# EAGLE design ps (EAGLE 7.6.0)
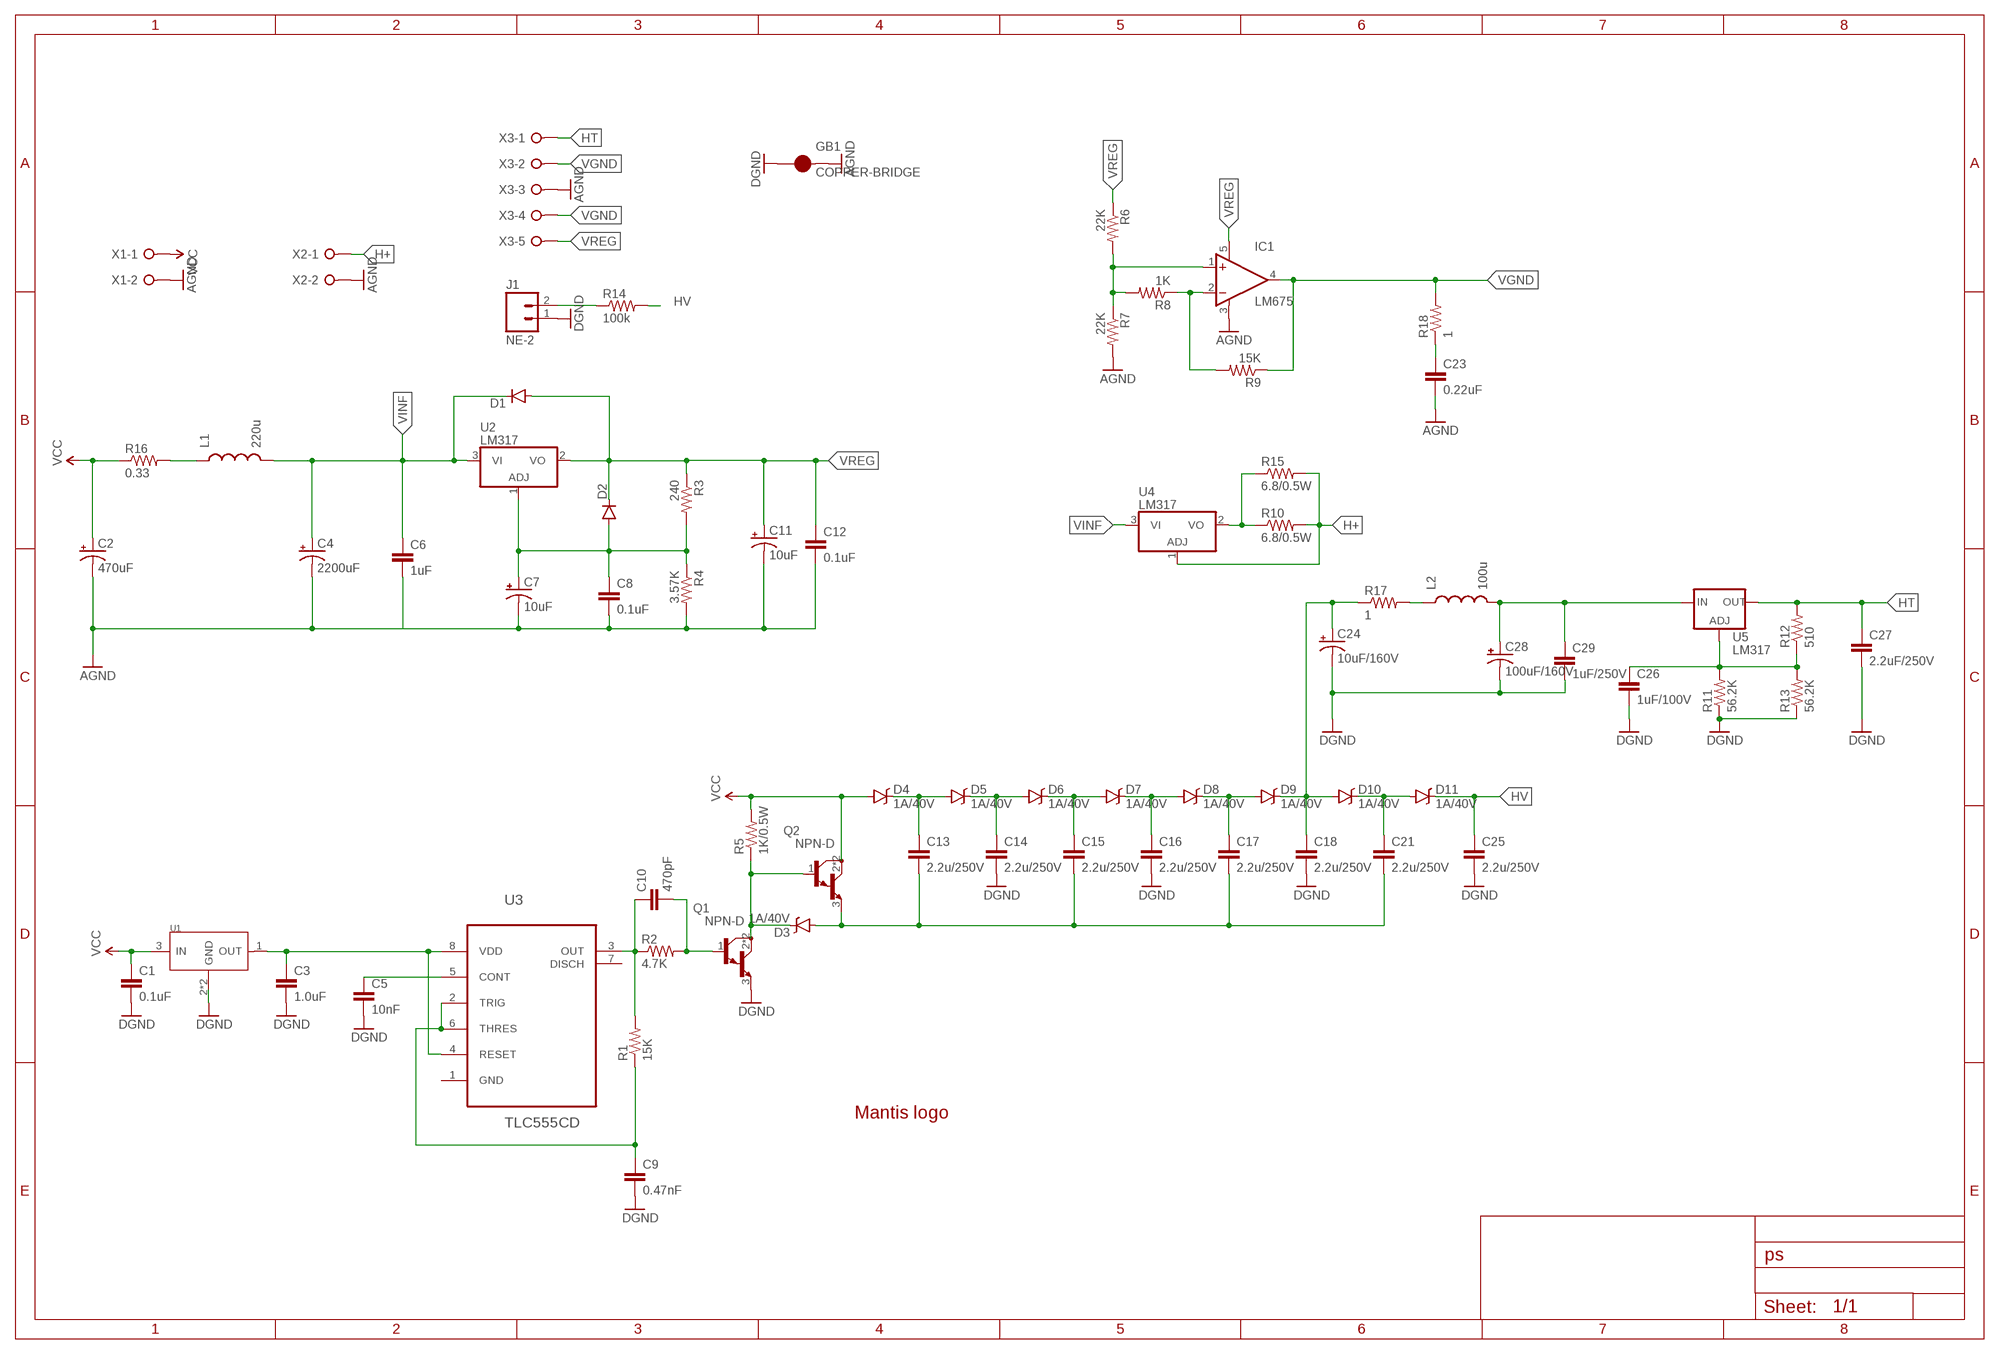
[diagram p0: schematic, sheet 1]

## Parts
C1  0.1uF  0.1UF-25V(+80/-20%)(0603)  [0603-CAP]
C2  470uF  CAP_POLPTH4  [CPOL-RADIAL-1000UF-25V]
C3  1.0uF  1.0UF-25V-+80/-20(0805)"  [0805-CAP]
C4  2200uF  CAP_POLPTH3  [CPOL-RADIAL-1000UF-63V]
C5  10nF  10NF/10000PF-50V-10%(0603)  [0603-CAP]
C6  1uF  1UF-25V-10%(0805)"  [0805-CAP]
C7  10uF  CAP_POLC  [PANASONIC_C]
C8  0.1uF  0.1UF-25V-5%(0603)  [0603-CAP]
C9  0.47nF  4.7NF-50V-10%(0603)  [0603-CAP]
C10  470pF  470PF-50V-5%(0603)SMD  [0603-CAP]
C11  10uF  CAP_POLC  [PANASONIC_C]
C12  0.1uF  0.1UF-25V-5%(0603)  [0603-CAP]
C13  2.2u/250V  C-EUC2220K  [C2220K]
C14  2.2u/250V  C-EUC2220K  [C2220K]
C15  2.2u/250V  C-EUC2220K  [C2220K]
C16  2.2u/250V  C-EUC2220K  [C2220K]
C17  2.2u/250V  C-EUC2220K  [C2220K]
C18  2.2u/250V  C-EUC2220K  [C2220K]
C21  2.2u/250V  C-EUC2220K  [C2220K]
C23  0.22uF  0.22UF-25V-10%(0603)  [0603-CAP]
C24  10uF/160V  CAP_POLPTH4  [CPOL-RADIAL-1000UF-25V]
C25  2.2u/250V  C-EUC2220K  [C2220K]
C26  1uF/100V  CAP1210  [1210]
C27  2.2uF/250V  C-EUC2220K  [C2220K]
C28  100uF/160V  CAP_POLPTH4  [CPOL-RADIAL-1000UF-25V]
C29  1uF/250V  C-EUC2220K  [C2220K]
D1  DIODESOD123  [SOD-123]
D2  DIODESOD123  [SOD-123]
D3  1A/40V  DIODE-SCHOTTKY-B340A  [SMA-DIODE]
D4  1A/40V  DIODE-SCHOTTKY-B340A  [SMA-DIODE]
D5  1A/40V  DIODE-SCHOTTKY-B340A  [SMA-DIODE]
D6  1A/40V  DIODE-SCHOTTKY-B340A  [SMA-DIODE]
D7  1A/40V  DIODE-SCHOTTKY-B340A  [SMA-DIODE]
D8  1A/40V  DIODE-SCHOTTKY-B340A  [SMA-DIODE]
D9  1A/40V  DIODE-SCHOTTKY-B340A  [SMA-DIODE]
D10  1A/40V  DIODE-SCHOTTKY-B340A  [SMA-DIODE]
D11  1A/40V  DIODE-SCHOTTKY-B340A  [SMA-DIODE]
GB1  COPPER-BRIDGE  [COPPER-BRIDGE]
IC1  LM675  [TO220-5]
J1  NE-2  M02PTH  [1X02]
L1  220u  INDUCTORNR10050T-PTH-ADD  [NR10050T-PTH-ADD]
L2  100u  INDUCTOR1210  [1210]
LOGO1  LOGO-MANTIS  [LOGO-MANTIS]
Q1  NPN-D  [SOT223]
Q2  NPN-D  [SOT223]
R1  15K  15KOHM1/10W1%(0603)0603  [0603-RES]
R2  4.7K  10KOHM-1/10W-1%(0603)0603  [0603-RES]
R3  240  RESISTORPTH-1/4W  [AXIAL-0.4]
R4  3.57K  RESISTORPTH-1/4W  [AXIAL-0.4]
R5  1K/0.5W  R-US_R1210W  [R1210W]
R6  22K  RESISTORPTH-1/4W  [AXIAL-0.4]
R7  22K  RESISTORPTH-1/4W  [AXIAL-0.4]
R8  1K  RESISTORPTH-1/4W  [AXIAL-0.4]
R9  15K  RESISTORPTH-1/4W  [AXIAL-0.4]
R10  6.8/0.5W  RESISTORPTH-1/2W  [AXIAL-0.5]
R11  56.2K  RESISTORPTH-1/4W  [AXIAL-0.4]
R12  510  RESISTORPTH-1/4W  [AXIAL-0.4]
R13  56.2K  RESISTORPTH-1/4W  [AXIAL-0.4]
R14  100k  100KOHM-1/10W-1%(0603)  [0603-RES]
R15  6.8/0.5W  RESISTORPTH-1/2W  [AXIAL-0.5]
R16  0.33  RESISTORPTH-1/4W  [AXIAL-0.4]
R17  1  RESISTORPTH-1/4W-VERT  [AXIAL-0.1]
R18  1  RESISTORPTH-1/4W  [AXIAL-0.4]
U1  L78L12ACUTR  [SOT-89]
U2  LM317  [TO220BV]
U3  TLC555CD  [SOIC127P600X175-8N]
U4  LM317  [TO220BV]
U5  LM317  V_REG_317DPACK  [V-REG_DPACK]
X1  W237-02P  [W237-132]
X2  W237-02P  [W237-132]
X3  W237-05P  [W237-5P]

## Nets
555CONT: C5.1 U3.5(CONT)
555OUT: C10.1 R1.2 R2.1 U3.3(OUT)
555TRIG: C9.1 R1.1 U3.2(TRIG) U3.6(THRES)
555VDD: C3.1 U1.1(OUT) U3.4(RESET) U3.8(VDD)
AGND: C2.- C4.2(-) C6.2 C7.- C8.2 C11.- C12.2 C23.2 GB1.P$2.1 GB1.P$2.2 IC1.3(V-) R4.P$2 R7.P$2 X1.2 X2.2 X3.3
GND: C1.2 C3.2 C5.2 C9.2 C14.2 C16.2 C18.2 C24.- C25.2 C26.2 C27.2 C28.- C29.2 GB1.P$1.1 GB1.P$1.2 J1.1 Q1.3(E) R11.P$1 R13.P$1 U1.2(GND) U1.PAD(GND) ; supply symbol labelled DGND
H+: R10.P$2 R15.P$2 U4.1(ADJ) X2.1
HT [pwr]: C27.1 R12.P$2 U5.4(OUT) X3.1
HV [pwr]: C25.1 D11.C R14.2
N$1 [pwr]: D3.C Q1.2(C) Q1.4(C) Q2.1(B) R5.1
N$2: IC1.1(+IN) R6.P$2 R7.P$1 R8.P$2
N$3: IC1.2(-IN) R8.P$1 R9.P$2
N$4 [pwr]: C21.1 D10.C D11.A
N$5: J1.2 R14.1
N$6 [pwr]: C13.1 D4.C D5.A
N$7 [pwr]: C28.+ C29.1 L2.2 U5.3(IN)
N$8: R10.P$1 R15.P$1 U4.2(VO)
N$9 [pwr]: L1.P$1 L1.P$1.1 R16.P$2
N$10: C10.2 Q1.1(B) R2.2
N$11 [pwr]: C14.1 D5.C D6.A
N$12 [pwr]: C15.1 D6.C D7.A
N$13 [pwr]: C16.1 D7.C D8.A
N$14 [pwr]: C17.1 D8.C D9.A
N$15 [pwr]: C18.1 C24.+ D9.C D10.A R17.P$1
N$16: L2.1 R17.P$2
N$17 [pwr]: C23.1 R18.P$1
N$18: C26.1 R11.P$2 R12.P$1 R13.P$2 U5.1(ADJ)
PUMPIN [pwr]: C13.2 C15.2 C17.2 C21.2 D3.A Q2.3(E)
REGADJ [pwr]: C7.+ C8.1 D2.A R3.P$2 R4.P$1 U2.1(ADJ)
VCC [pwr]: C1.1 C2.+ D4.A Q2.2(C) Q2.4(C) R5.2 R16.P$1 U1.3(IN) X1.1
VGND [pwr]: IC1.4(OUT) R9.P$1 R18.P$2 X3.2 X3.4
VINF [pwr]: C4.1(+) C6.1 D1.C L1.P$2 L1.P$2.1 U2.3(VI) U4.3(VI)
VREG [pwr]: C11.+ C12.1 D1.A D2.C IC1.5(V+) R3.P$1 R6.P$1 U2.2(VO) X3.5
Unconnected: U3.1(GND) U3.7(DISCH)

## Library data of the parts
C1 = SparkFun-Capacitors:0.1UF-25V(+80/-20%)(0603): CAP-00810 Ceramic Standard decoupling cap; PROD_ID: CAP-00810
C2 C4 C7 C11 C24 C28 = SparkFun-Capacitors:CAP_POL: Capacitor Polarized These are standard SMD and PTH capacitors. Normally 10uF, 47uF, and 100uF in electrolytic and tantalum varieties. Always verify the external diameter of the through hole cap, it varies with capacity, voltage, and manufacturer. The EIA devices should be standard.
C3 = SparkFun-Capacitors:1.0UF-25V-+80/-20(0805): CAP-11625; PROD_ID: CAP-11625
C5 = SparkFun-Capacitors:10NF/10000PF-50V-10%(0603): CAP-00867; PROD_ID: CAP-00867
C6 = SparkFun-Capacitors:1UF-25V-10%(0805): CAP-08064
C8 C12 = SparkFun-Capacitors:0.1UF-25V-5%(0603): CAP-08604; PROD_ID: CAP-08604
C9 = SparkFun-Capacitors:4.7NF-50V-10%(0603): CAP-11378; PROD_ID: CAP-11378; VALUE: 4.7nF
C10 = SparkFun-Capacitors:470PF-50V-5%(0603): CAP-07884; PROD_ID: CAP-07884
C13-C18 C21 C25 C27 C29 = rcl:C-EU: CAPACITOR, European symbol
C23 = SparkFun-Capacitors:0.22UF-25V-10%(0603): CAP-07822; PROD_ID: CAP-07822
C26 = SparkFun-Capacitors:CAP: Capacitor Standard 0603 ceramic capacitor, and 0.1" leaded capacitor.
D1 D2 = SparkFun-DiscreteSemi:DIODE: Diode These are standard reverse protection diodes and small signal diodes. SMA package can handle up to about 1A. SOD-323 can handle about 200mA. What the SOD-323 package when ordering, there are some mfgs out there that are 5-pin packages.
D3-D11 = SparkFun-DiscreteSemi:DIODE-SCHOTTKY: Schottky diodes in SFE's production catalog BAT20J 1A 23V 0.62Vf RB751 120mA 40V 0.37Vf PMEG4005EJ 0.5A 40V 0.42Vf MBRA140 1A 40V 0.5Vf B340A 3A 40V SMA; PROD_ID: DIO-09886; VALUE: B340A
GB1 = my:COPPER-BRIDGE
IC1 = my:LM675: Power Operational Amplifier
J1 = SparkFun-Connectors:M02: Standard 2-pin 0.1" header. Use with - straight break away headers ( PRT-00116) - right angle break away headers (PRT-00553) - swiss pins (PRT-00743) - machine pins (PRT-00117) - female headers (PRT-00115) Molex polarized connector foot print use with: PRT-08233 with associated crimp pins and housings. 2.54_SCREWTERM for use with PRT-10571. 3.5mm Screw Terminal footprints for PRT-08084 5mm Screw Terminal footprints for use with PRT-08432
L1 = my:INDUCTOR: Inductors Basic Inductor/Choke - 0603 and 1206. Footprints are not proven and vary greatly between part numbers. INDUCTOR POWER 3.3UH 4.0A SMD 0.197" L x 0.197" W x 0.177" H (5.00mm x 5.00mm x 4.50mm)
L2 = SparkFun-Passives:INDUCTOR: Inductors Basic Inductor/Choke - 0603 and 1206. Footprints are not proven and vary greatly between part numbers. INDUCTOR POWER 3.3UH 4.0A SMD 0.197" L x 0.197" W x 0.177" H (5.00mm x 5.00mm x 4.50mm); MOUSER_PRICE: 0.168; MOUSER_SKU: 963-LB3218T101K
LOGO1 = my:LOGO-MANTIS: Mantis logo
Q1 Q2 = my:NPN-D: Generic NPN Darlington transistor
R1 = SparkFun-Resistors:15KOHM1/10W1%(0603): RES-07854; PROD_ID: RES-07854
R2 = SparkFun-Resistors:10KOHM-1/10W-1%(0603): RES-00824; PROD_ID: RES-00824; VALUE: 10K
R3 R4 R6-R13 R15-R18 = SparkFun-Resistors:RESISTOR: Resistor Basic schematic elements and footprints for 0603, 1206, and PTH resistors.
R5 = rcl:R-US_: RESISTOR, American symbol
R14 = SparkFun-Resistors:100KOHM-1/10W-1%(0603): RES-07828; PROD_ID: RES-07828
U1 = my:L78L12ACUTR: 310030095
U2 U4 = my:LM317
U3 = Texas Instruments_By_element14_Batch_1:TLC555CD: LINCMOS TIMER; MPN: TLC555CD; OC_FARNELL: 1106128; OC_NEWARK: 67K1265; PACKAGE: SOIC-8; SUPPLIER: Texas Instruments
U5 = SparkFun-PowerIC:V_REG_317: Voltage Regulator Standard LM317 adjustable voltage regulator. AOI (Adjust Output Input). Google 'LM317 Calculator' for easy to use app to get the two resistor values needed. 240/720 for 5V output. 240/390 for 3.3V output. Spark Fun Electronics SKU : COM-00527; PROD_ID: IC-09888
X1 X2 = con-wago-508:W237-02P: WAGO SREW CLAMP; OC_FARNELL: unknown; OC_NEWARK: unknown
X3 = con-wago-508:W237-05P: WAGO SREW CLAMP; OC_FARNELL: unknown; OC_NEWARK: unknown

## Net classes
1 pwr: width 1.27 mm

## Board
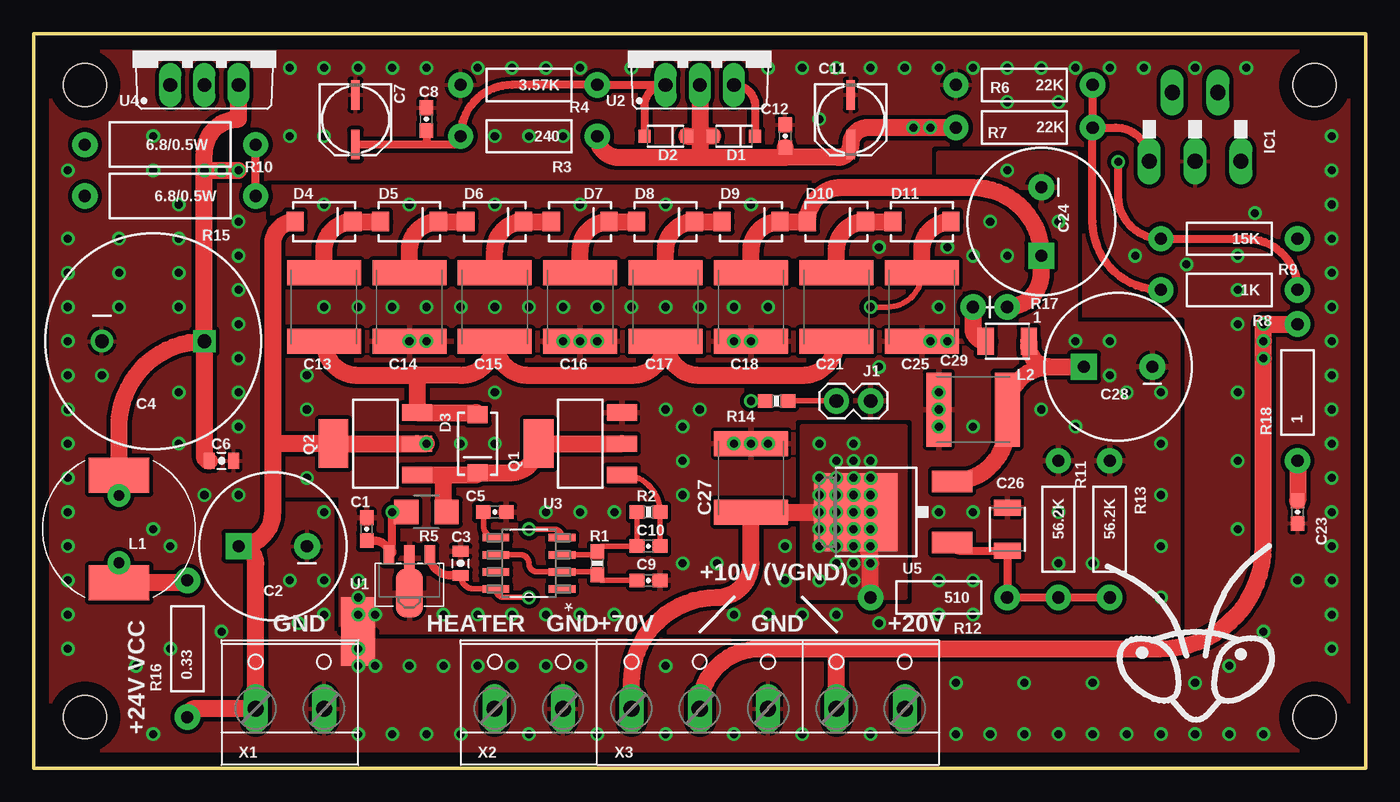
[diagram p1: board, top side]
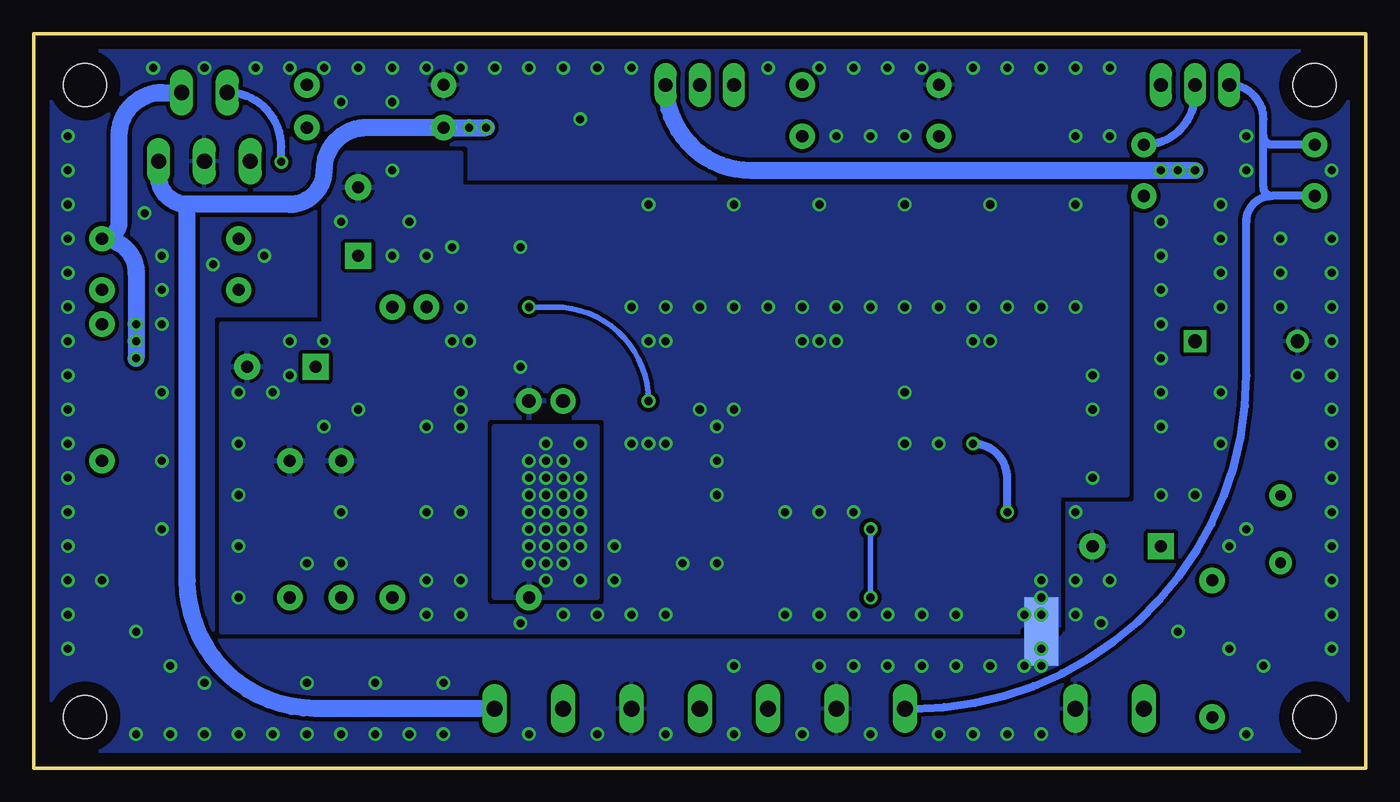
[diagram p2: board, bottom side, seen from below]

Size 99.06 x 54.61 mm. Coordinates in mm from the lower left corner, seen from the top.
Outline: 0,0 0,54.61 99.06,54.61 99.06,0 0,0
Copper layers (1*16): Top 0.035mm / dielectric 1.5mm / Bottom 0.035mm
Design rules "default *": minimum track width 10mil, minimum drill 20mil, track to track 12mil, track to pad 12mil, pad to pad 12mil, via to via 12mil, smd to smd 8mil, copper to edge 40mil, drill to drill 8mil, minimum pad ring 12mil, minimum via ring 8mil, stop-mask expansion 4mil, vias tented up to drill 0mil, thermal gap 10mil
Holes 3.2 mm at 3.81,3.81 3.81,50.8 95.25,50.8 95.25,3.81

### Footprints (pad centres in the part's own frame; a part is rotated, then mirrored left to right if it is on the bottom)
0603-CAP = smd 1.1 x 1: 1 -0.85,0; 2 0.85,0
CPOL-RADIAL-1000UF-25V = drill 0.9 pad 1.93 square: + 2.54,0 | drill 0.9 pad 1.93: - -2.54,0
0805-CAP = smd 0.8 x 1.2: 1 -0.9,0; 2 0.9,0
CPOL-RADIAL-1000UF-63V = drill 1.016 pad 1.651 square: 1 3.81,0 | drill 1.016 pad 1.676: 2 -3.81,0
PANASONIC_C = smd 2.2 x 0.65: + 1.9,-0.2; - -1.8,-0.2
C2220K = smd 1.85 x 5.5: 1 -2.55,0; 2 2.55,0
1210 = smd 1.2 x 2: 1 -1.6,0; 2 1.6,0
SOD-123 = smd 0.9 x 0.95: A 1.575,0; C -1.575,0
SMA-DIODE = smd 1.27 x 1.47: A -2.15,0; C 2.15,0
COPPER-BRIDGE = smd 2.54 x 2.565: P$1.1 0,1.27; P$2.1 0,-1.27 | smd 2.54 x 2.565 bottom: P$1.2 0,1.27; P$2.2 0,-1.27
TO220-5 = drill 1.118 pad 1.626 long: 1 -3.404,-8.211; 2 -1.702,-3.105; 3 0,-8.211; 4 1.702,-3.105; 5 3.404,-8.211
1X02 = drill 1.016 pad 1.88: 1 0,0; 2 2.54,0
NR10050T-PTH-ADD = smd 4.5 x 2.6: P$1 0,4; P$2 0,-4 | drill 0.8 pad 1.676: P$1.1 0,2.5; P$2.1 0,-2.5
SOT223 = smd 1.219 x 2.235: 1 -2.311,-3.099; 2 0,-3.099; 3 2.311,-3.099 | smd 3.6 x 2.2: 4 0,3.099
0603-RES = smd 1.1 x 1: 1 -0.85,0; 2 0.85,0
AXIAL-0.4 = drill 0.9 pad 1.88: P$1 -5.08,0; P$2 5.08,0
R1210W = smd 1.8 x 1.8: 1 -1.499,0; 2 1.499,0
AXIAL-0.5 = drill 0.9 pad 1.88: P$1 -6.35,0; P$2 6.35,0
AXIAL-0.1 = drill 0.9 pad 1.88: P$1 0,0; P$2 2.54,0
SOT-89 = smd 0.8 x 1.4: 1 -1.524,-1.905; 3 1.524,-1.905 | smd 0.8 x 1.9: 2 0,-1.651 | smd 2.032 x 3.65: PAD 0,0.94
TO220BV = drill 1.016 long: 1 -2.54,-2.54; 2 0,-2.54; 3 2.54,-2.54
SOIC127P600X175-8N = smd 1.981 x 0.559: 1 -2.464,1.905; 2 -2.464,0.635; 3 -2.464,-0.635; 4 -2.464,-1.905; 5 2.464,-1.905; 6 2.464,-0.635; 7 2.464,0.635; 8 2.464,1.905
V-REG_DPACK = smd 1.6 x 3: 1 -2.28,-4.8; 3 2.28,-4.8 | smd 5.8 x 6.2: 4 0,2.38
W237-132 = drill 1.194 long: 1 -2.54,-0.635; 2 2.54,-0.635
W237-5P = drill 1.194 long: 1 -10.16,-0.635; 2 -5.08,-0.635; 3 0,-0.635; 4 5.08,-0.635; 5 10.16,-0.635

### Placement (x,y rotation side)
C1  24.77,17.78 90 top
C2  17.78,16.51 180 top
C3  31.75,15.24 90 top
C4  8.89,31.75 0 top
C5  34.29,19.05 0 top
C6  13.97,22.86 0 top
C7  24.13,48.26 270 top
C8  29.21,48.26 90 top
C9  45.72,13.97 0 top
C10  45.72,16.51 0 top
C11  60.96,48.26 270 top
C12  55.88,46.99 90 top
C13  21.59,34.29 270 top
C14  27.94,34.29 270 top
C15  34.29,34.29 270 top
C16  40.64,34.29 270 top
C17  46.99,34.29 270 top
C18  53.34,34.29 270 top
C21  59.69,34.29 270 top
C23  93.98,19.05 270 top
C24  74.93,40.64 270 top
C25  66.04,34.29 270 top
C26  72.39,17.78 90 top
C27  53.34,21.59 90 top
C28  80.64,29.84 180 top
C29  69.85,26.67 180 top
D1  52.07,46.99 180 top
D2  46.99,46.99 180 top
D3  33.02,24.13 270 top
D4  21.59,40.64 0 top
D5  27.94,40.64 0 top
D6  34.29,40.64 0 top
D7  40.64,40.64 0 top
D8  46.99,40.64 0 top
D9  53.34,40.64 0 top
D10  59.69,40.64 0 top
D11  66.04,40.64 0 top
GB1  24.13,10.16 0 top
IC1  86.36,53.34 0 top
J1  62.23,27.3 180 top
L1  6.35,17.78 180 top
L2  72.39,31.75 0 top
LOGO1  86.36,10.16 0 top
Q1  40.64,24.13 90 top
Q2  25.4,24.13 90 top
R1  41.91,15.24 90 top
R2  45.72,19.05 0 top
R3  36.83,46.99 180 top
R4  36.83,50.8 180 top
R5  29.21,19.05 180 top
R6  73.66,47.62 0 top
R7  73.66,50.8 180 top
R8  88.9,35.56 180 top
R9  88.9,39.37 180 top
R10  10.16,46.35 180 top
R11  76.2,17.78 270 top
R12  67.31,12.7 180 top
R13  80.01,17.78 270 top
R14  55.24,27.3 180 top
R15  10.16,42.55 180 top
R16  11.43,8.89 90 top
R17  72.39,34.29 180 top
R18  93.98,27.94 90 top
U1  27.94,13.97 180 top
U2  49.53,53.34 0 top
U3  36.83,15.24 180 top
U4  12.7,53.34 0 top
U5  63.5,19.05 90 top
X1  19.05,5.08 0 top
X2  36.83,5.08 0 top
X3  54.61,5.08 0 top

### Tracks (layer width: path | path; a pad name or v marks a point on that pad's centre or on a via)
555CONT
  Top 0.406: U3.5 arc-90 33.44,18.07 C5.1
555OUT
  Top 0.406: R2.1 C10.1 42.33,16.51 arc90 R1.2 arc-90 41.7,15.88 U3.3
555TRIG
  Top 0.406: U3.6 36.2,15.88 arc-90 36.83,15.24 arc90 37.47,14.61 U3.2 41.7,14.61 arc-90 R1.1 arc90 42.33,13.97 C9.1
555VDD  (via drill 0.6)
  Top 0.406: v36.83,12.7 35,12.7 arc-90 U3.8 32.76,13.34 arc-90 C3.1 | v36.83,17.78 38.66,17.78 arc-90 U3.4
  Top 0.61: C3.1 31,14.34 arc-90 U1.1
  Bottom 0.406: v36.83,12.7 v36.83,17.78
AGND  (via drill 0.6)
  other vias: 2.54,8.89 2.54,11.43 2.54,13.97 2.54,16.51 2.54,19.05 2.54,21.59 2.54,24.13 2.54,26.67 2.54,29.21 2.54,31.75 2.54,34.29 2.54,36.83 2.54,39.37 2.54,44.45 19.05,52.07 21.59,52.07 24.13,52.07 26.67,52.07 29.21,52.07 33.02,52.07 35.56,52.07 38.1,52.07 40.64,52.07 44.45,52.07 54.61,52.07 57.15,52.07 59.69,52.07 62.23,52.07 64.77,52.07 67.31,52.07 69.85,52.07 72.39,52.07 74.93,52.07 77.47,52.07 80.01,52.07 82.55,52.07 86.36,52.07 90.17,52.07 96.52,46.99 96.52,44.45 96.52,41.91 96.52,39.37 96.52,36.83 96.52,34.29 96.52,31.75 96.52,29.21 96.52,26.67 96.52,24.13 96.52,21.59 96.52,19.05 96.52,16.51 96.52,13.97 96.52,11.43 96.52,8.89 91.44,2.54 88.9,2.54 86.36,2.54 83.82,2.54 81.28,2.54 78.74,2.54 76.2,2.54 73.66,2.54 71.12,2.54 68.58,2.54 62.23,2.54 57.15,2.54 52.07,2.54 46.99,2.54 41.91,2.54 36.83,2.54 31.75,2.54 29.21,2.54 26.67,2.54 24.13,2.54 7.62,7.62 8.89,2.54 13.97,10.16 8.89,17.78 5.08,29.21 6.35,34.29 6.35,36.83 6.35,39.37 10.79,39.37 10.79,41.91 8.89,44.45 8.89,46.99 10.79,36.83 10.79,34.29 10.79,27.94 10.79,24.13 12.7,20.32 10.16,16.51 19.05,13.97 19.68,10.79 25.4,7.62 27.94,7.62 15.24,25.4 15.24,27.94 15.24,30.48 15.24,33.02 15.24,35.56 15.24,38.1 15.24,40.64 30.48,7.62 33.02,7.62 35.56,7.62 38.1,7.62 40.64,7.62 46.99,7.62 68.58,6.35 73.66,6.35 78.74,6.35 93.98,13.97 86.36,6.35 88.9,7.62 91.44,10.16 89.53,17.78 89.53,27.94 89.53,33.02 19.05,46.99 21.59,46.99 34.29,46.99 36.83,46.99 39.37,46.99 58.42,48.26 76.2,49.53 72.39,49.53 15.24,20.32 21.59,13.97 21.59,11.43 21.59,19.05 10.16,8.89 24.13,7.62 24.13,8.89 89.53,22.86 89.53,35.56 89.53,38.1 90.81,41.27 85.72,37.47 81.92,38.1
  pour Top (isolate 0.305, rank 3): 0,54.61 0,0 99.06,0 99.06,54.61
  pour Bottom (isolate 0.305, rank 3): 0,54.61 0,0 99.06,0 99.06,54.61
GND  (via drill 0.6)
  other vias: 29.21,31.75 39.37,31.75 41.91,31.75 52.07,31.75 27.94,31.75 40.64,31.75 53.34,31.75 67.94,31.75 66.67,31.75 53.34,24.13 54.61,24.13 67.31,26.67 67.31,27.94 21.59,41.91 27.94,41.91 34.29,41.91 40.64,41.91 46.99,41.91 53.34,41.91 20.32,29.21 20.32,26.67 20.32,21.59 24.13,13.97 30.48,11.43 33.02,11.43 35.56,11.43 38.1,11.43 40.64,11.43 43.18,11.43 52.07,11.43 54.61,11.43 57.15,11.43 59.69,11.43 55.88,13.97 55.88,16.51 50.8,15.24 48.26,15.24 43.18,19.05 40.64,19.05 38.1,19.05 48.26,20.32 48.26,22.86 48.26,25.4 46.99,26.67 49.53,26.67 34.29,27.94 34.29,24.13 31.75,24.13 72.39,38.1 71.12,40.64 72.39,44.45 76.2,40.64 77.47,31.75 80.01,31.75 83.82,27.94 81.28,27.94 80.01,29.21 74.93,26.67 83.82,24.13 83.82,20.32 83.82,16.51 83.82,12.7 78.74,15.24 76.2,15.24 69.85,11.43 67.31,11.43 69.85,19.05 76.2,19.05 52.07,24.13 67.31,25.4 67.31,13.97 67.31,19.05 67.31,34.29 69.85,25.4 67.94,38.73 62.87,38.73 62.87,29.84 62.87,10.79 69.85,13.97 24.13,12.7 25.4,11.43 24.13,11.43 54.61,34.29 52.07,34.29 49.53,34.29 46.99,34.29 44.45,34.29 41.91,34.29 39.37,34.29 36.83,34.29 34.29,34.29 31.75,34.29 29.21,34.29 26.67,34.29 24.13,34.29 21.59,34.29 69.85,38.1 77.47,25.4
  pour Top (isolate 0.305, rank 2): 22.86,20.32 22.86,10.16 85.09,10.16 85.09,33.02 77.47,33.02 77.47,45.72 67.31,45.72 67.31,43.18 17.78,43.18 17.78,20.32
  pour Bottom (isolate 0.305, rank 2): 17.78,43.18 67.31,43.18 67.31,45.72 77.47,45.72 77.47,33.02 85.09,33.02 85.09,10.16 22.86,10.16 22.86,20.32 17.78,20.32
H+
  Bottom 0.61: 7.62,46.99 7.62,43.18 arc-90 6.99,42.55 | 7.62,46.99 7.62,48.26 arc-90 U4.1 | R15.P$2 6.99,42.55 | R10.P$2 6.99,46.35 arc90 7.62,46.99 | X2.1 33.66,4.45 arc-90 8.89,29.21 8.89,40.64 arc90 6.99,42.55
HT  (via drill 0.6)
  Top 1.27: X3.1 44.45,6.35 arc-90 50.8,12.7 arc90 53.34,15.24 C27.1 v58.41,19.04 arc90 v58.42,19.05 arc-90 v62.23,15.24 R12.P$2
  other vias: 60.96,24.13 58.42,24.13 59.69,22.86 62.23,22.86 60.96,21.59 60.96,19.05 60.96,16.51 62.23,17.78 62.23,20.32 59.69,20.32 59.69,17.78 58.42,16.51 59.69,15.24 58.42,13.97 60.96,13.97 58.42,21.59 60.96,22.86 60.96,20.32 59.69,21.59 58.42,20.32 59.69,19.05 58.42,17.78 59.69,16.51 60.96,17.78 62.23,19.05 62.23,21.59 62.23,16.51 60.96,15.24
  pour Top (isolate 0.305, no thermals): 57.15,12.7 57.15,25.4 64.77,25.4 64.77,12.7
  pour Bottom: 57.15,12.7 57.15,25.4 64.77,25.4 64.77,12.7
HV  (via drill 0.6)
  Top 0.406: v62.23,34.29 63.49,34.29 arc90 C25.1 | R14.2 v53.34,27.3
  Top 1.27: C25.1 66.04,38.49 arc-90 D11.C
  Bottom 0.406: v53.34,27.3 arc-90 60.33,34.29 v62.23,34.29
N$1
  Top 1.27: Q2.1 30.48,21.82 | 30.48,21.82 32.86,21.82 arc90 D3.C 35.39,21.98 arc90 Q1.4 Q1.2 | R5.1 arc90 30.48,19.47 30.48,21.82
N$2
  Top 0.61: R7.P$1 R6.P$2 | R8.P$2 arc-90 78.74,40.64 R6.P$2 | R6.P$2 80.46,47.62 arc-90 IC1.1
N$3  (via drill 0.6)
  Top 0.61: R8.P$1 arc90 90.17,39.37 R9.P$2 arc-90 80.64,42.55 v80.64,45.09
  Bottom 0.61: v80.64,45.09 80.64,46.22 arc-90 IC1.2
N$4
  Top 1.27: C21.1 59.69,38.49 arc-90 D10.C D11.A
N$5
  Top 0.406: R14.1 J1.2
N$6
  Top 1.27: C13.1 21.59,38.49 arc-90 D4.C D5.A
N$7
  Top 1.27: U5.3 arc90 72.4,25.43 C29.1 arc-90 75.58,29.84 | 75.58,29.84 C28.+ | L2.2 73.99,31.43 arc90 75.58,29.84
N$8
  Top 0.61: R15.P$1 R10.P$1
  Bottom 0.61: R10.P$1 arc-90 12.7,50.16 U4.2
N$9
  Top 1.27: L1.P$1.1 L1.P$1 11.24,13.78 arc90 R16.P$2
N$10
  Top 0.406: C10.2 R2.2 arc90 43.8,21.82 Q1.1 arc-90 44.03,21.53
N$11
  Top 1.27: C14.1 27.94,38.49 arc-90 D5.C D6.A
N$12
  Top 1.27: C15.1 34.29,38.49 arc-90 D6.C D7.A
N$13
  Top 1.27: C16.1 40.64,38.49 arc-90 D7.C D8.A
N$14
  Top 1.27: C17.1 46.99,38.49 arc-90 D8.C D9.A
N$15
  Top 1.27: C18.1 53.34,38.49 arc-90 D9.C D10.A arc-90 60.08,43.18 69.85,43.18 arc-90 C24.+ 74.93,36.83 arc-90 R17.P$1
N$16
  Top 1.27: R17.P$2 69.85,32.69 arc90 L2.1
N$17
  Top 1.27: R18.P$1 C23.1
N$18
  Top 0.61: R13.P$2 R11.P$2 R12.P$1 C26.1 68.89,16.18 arc-90 U5.1
PUMPIN
  Top 1.27: D3.A arc90 32.86,26.44 Q2.3 28.5,29.21 | 21.42,31.91 arc-90 C13.2 arc90 24.12,29.21 28.5,29.21 | C21.2 arc-90 57.16,29.21 49.52,29.21 arc-90 C17.2 arc-90 44.46,29.21 36.82,29.21 arc-90 C15.2 arc-90 31.76,29.21 28.5,29.21
REGADJ
  Top 0.61: 29.21,46.36 31.12,46.36 arc90 R3.P$2 arc-90 35.56,50.8 R4.P$1 U2.1 arc90 45.41,49.23 D2.A | 29.21,46.36 C7.+ | C8.1 29.21,46.36
VCC  (via drill 0.6)
  Top 0.61: C1.1 25.36,16.93 arc-90 U1.3 arc90 26.67,16.13 v26.67,19.05 R5.2 27.94,19.05
  Top 1.27: D4.A arc90 17.78,38.98 17.78,24.13 | 17.78,24.13 17.78,19.05 arc-90 C2.+ arc-90 16.51,15.24 X1.1 12.06,4.45 arc90 R16.P$1 | 17.78,24.13 Q2.4 Q2.2 v29.21,24.13
  Bottom 0.61: v26.67,19.05 26.67,21.59 arc-90 v29.21,24.13
VGND  (via drill 0.6)
  Top 1.27: X3.2 arc-90 53.98,8.89 59.69,8.89 | X3.4 59.69,8.89 | 59.69,8.89 83.82,8.89 arc90 91.44,16.51 v91.44,30.48 v91.44,31.75 v91.44,33.02 R18.P$2
  Bottom 1.27: IC1.4 89.47,50.23 arc-90 92.71,46.99 92.71,40.64 arc90 R9.P$1 arc90 91.44,36.83 v91.44,33.02 v91.44,31.75 v91.44,30.48
VINF  (via drill 0.6)
  Top 0.61: U2.3 arc-90 53.65,49.23 D1.C
  Top 1.27: C4.1 arc90 6.35,25.4 L1.P$2 L1.P$2.1 | C4.1 v12.7,44.45 | v12.7,44.45 12.7,45.72 arc-90 15.24,48.26 U4.3 | C4.1 12.7,23.23 arc90 C6.1 | v12.7,44.45 v13.97,44.45 v15.24,44.45
  Bottom 1.27: U2.3 arc-90 45.72,44.45 v15.24,44.45 v13.97,44.45 v12.7,44.45
VREG  (via drill 0.6)
  Top 1.27: R3.P$1 arc90 43.48,45.41 49.53,45.41 | C12.1 55.88,45.41 | U2.2 49.53,46.99 | 49.53,46.99 49.53,45.41 | 49.53,45.41 55.88,45.41 | D1.A 49.53,46.99 | D2.C 49.53,46.99 | 55.88,45.41 59.81,45.41 arc90 C11.+ arc-90 62.02,47.62 v65.41,47.62 v66.67,47.62 R6.P$1
  Bottom 1.27: v65.41,47.62 v66.67,47.62 R6.P$1 74.3,47.62 arc-90 77.47,44.45 arc90 80.01,41.91 87.63,41.91 | 87.63,41.91 arc90 89.76,44.04 IC1.5 | X3.5 78.11,4.45 arc90 87.63,13.97 87.63,41.91

### Text on the board
tPlace: +10V (VGND) | GND | HEATER | GND | +70V | GND | +20V | +24V VCC